# Altium schematic sheet Stabilizator.SchDoc
size A4
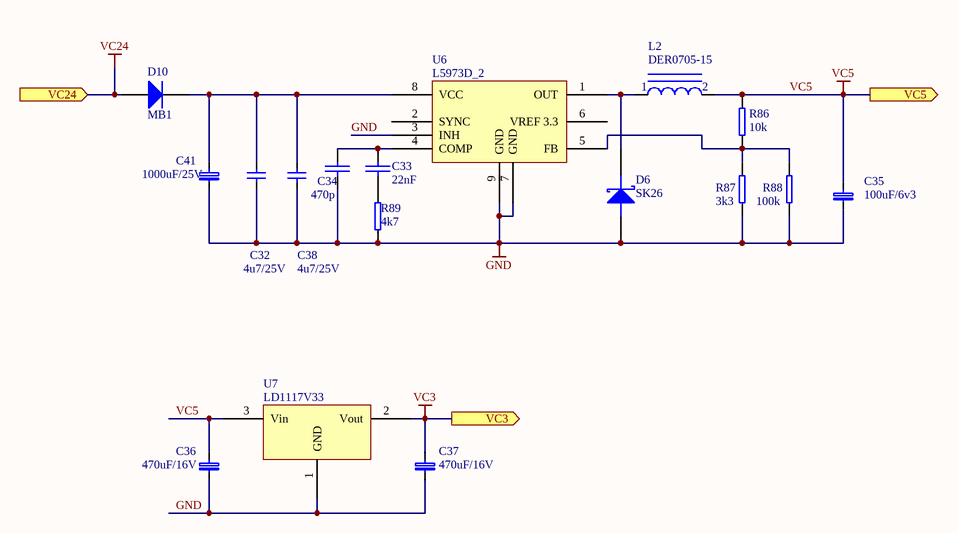
[diagram p0: Stabilizator.SchDoc]

## Parts
C32  4u7/25V  [1206]
C33  22nF  [0805C]
C34  470p  [0805C]
C35  100uF/6v3  [CAP_C]
C36  470uF/16V  [RB-.15/.30]
C37  470uF/16V  [RB-.15/.30]
C38  4u7/25V  [1206]
C41  1000uF/25V  [RB-.2/.4]
D6  SK26  [RD5]
D10  MB1  [SMB]
L2  DER0705-15  [DER0705_1]
R86  10k  [0805R]
R87  3k3  [0805R]
R88  100k  [0805R]
R89  4k7  [0805R]
U6  L5973D_2  [SO8_M]
U7  LD1117V33  [DPAK]

## Ports
VC3 (out), VC5 (out), VC24 (in)

## Nets
GND: C32.1 C34.2 C35.1 C36.1 C37.1 C38.1 C41.1 D6.A R87.2 R88.2 R89.2 U6.3(INH) U6.7(GND) U6.9(GND) U7.1(GND)
VC3: C37.2 U7.2(Vout) ; port VC3
VC5: C35.2 C36.2 L2.2 R86.1 U7.3(Vin) ; port VC5
VC24: D10.A ; port VC24
NetC32_2: C32.2 C38.2 C41.2 D10.K U6.8(VCC)
NetC33_1: C33.1 R89.1
NetC33_2: C33.2 C34.1 U6.4(COMP)
NetD6_K: D6.K L2.1 U6.1(OUT)
NetR86_2: R86.2 R87.1 R88.1 U6.5(FB)

Not connected (* = marked no-connect by the designer): U6 2(SYNC) 6(VREF_3.3)

## Library data of the parts
C32 C38 = CAP
C33 C34 = CAP: Capacitor
C35-C37 C41 = CAP_TANTAL_SMD: KONDENSATOR ELEKTROLITYCZNY TANTALOWY SMD
D6 = DIODE SCHOTTKY: Schottky Diode
D10 = Diode: Default Diode; Published: 8-Jun-2000; LatestRevisionDate: 17-Jul-2002; LatestRevisionNote: Re-released for DXP Platform.; PackageVersion: Sep-1996; PackageReference: SMC; Publisher: Altium Limited; PackageDescription: DO-214-AB/SMC; 2 C-Bend Leads; Body 7.9 x 5.9 mm, inc. leads (LxW); Code_JEDEC: DO-214-AB
L2 = CEWKA_1
R86-R89 = RES3